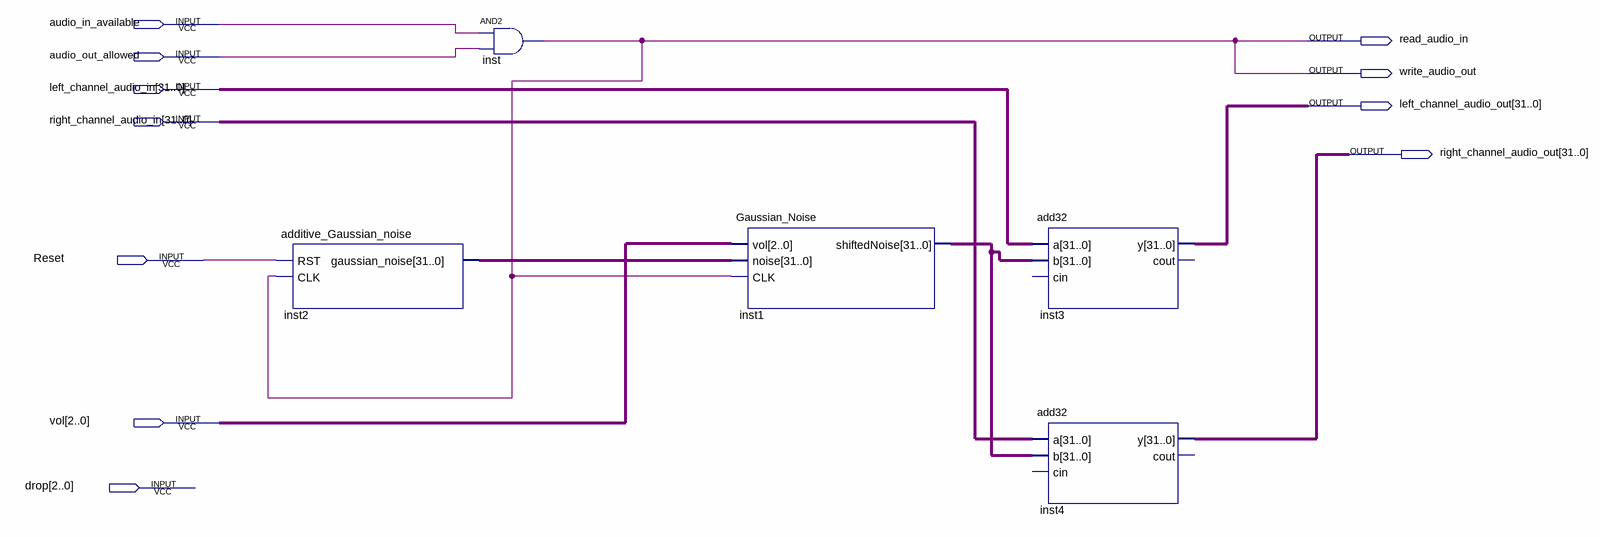
[diagram p0: schematic sheet]
// Quartus schematic filter_demo.bdf as structural Verilog: 5 symbols, 11 pins
module filter_demo (
  input  audio_in_available,
  input  audio_out_allowed,
  input  [31:0] left_channel_audio_in,
  input  [31:0] right_channel_audio_in,
  input  Reset,
  input  [2:0] vol,
  input  [2:0] drop,
  output read_audio_in,
  output write_audio_out,
  output [31:0] left_channel_audio_out,
  output [31:0] right_channel_audio_out
);

  wire [31:0] inst1_shiftednoise, inst2_gaussian_noise;

  additive_Gaussian_noise inst2 (.RST(Reset), .CLK(read_audio_in), .gaussian_noise(inst2_gaussian_noise));
  and inst (read_audio_in, audio_in_available, audio_out_allowed);
  Gaussian_Noise inst1 (
    .vol(vol), .noise(inst2_gaussian_noise), .CLK(read_audio_in), .shiftedNoise(inst1_shiftednoise));
  add32 inst3 (.a(left_channel_audio_in), .b(inst1_shiftednoise), .y(left_channel_audio_out));  // open: cin, cout
  add32 inst4 (.a(right_channel_audio_in), .b(inst1_shiftednoise), .y(right_channel_audio_out));  // open: cin, cout

  assign write_audio_out = read_audio_in;
endmodule
